# EAGLE schematic WizHorizonObserver (EAGLE 9.6.2)
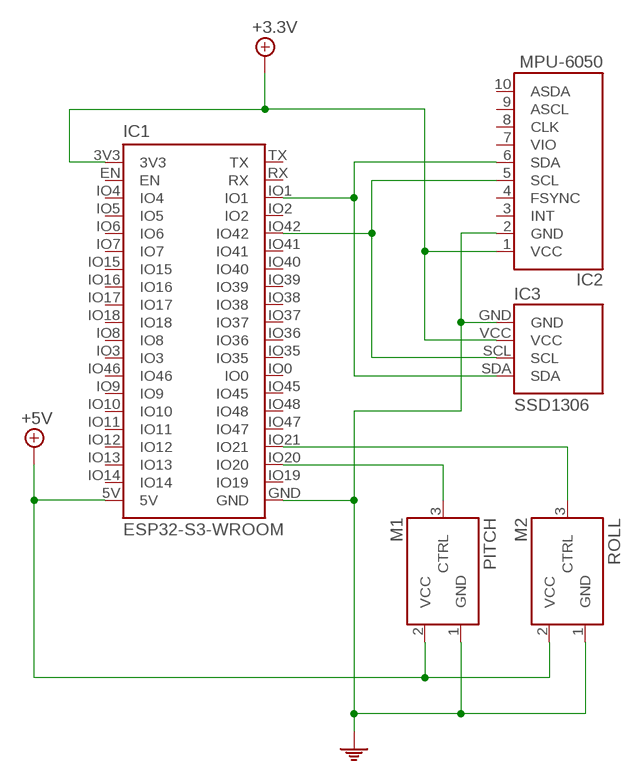
[diagram p0: schematic, sheet 1]

## Parts
IC1  ESP32-S3-WROOM  [ESP32-S3-WROOM]
IC2  MPU-6050  MPU-6050SIL10  [SIL10]
IC3  SSD1306  [SSD1306]
M1  PITCH  SERVO-MOTORSIL3  [SIL3]
M2  ROLL  SERVO-MOTORSIL3  [SIL3]

## Nets
+3.3V: IC1.3V3 IC2.1(VCC) IC3.VCC
+5V: IC1.5V M1.2(VCC) M2.2(VCC)
GND: IC1.GND IC2.2(GND) IC3.GND M1.1(GND) M2.1(GND)
N$1: IC1.IO20 M1.3(CTRL)
N$2: IC1.IO21 M2.3(CTRL)
N$3: IC1.IO1 IC2.6(SDA) IC3.SDA
N$4: IC1.IO42 IC2.5(SCL) IC3.SCL
Unconnected: IC1.EN IC1.IO0 IC1.IO2 IC1.IO3 IC1.IO4 IC1.IO5 IC1.IO6 IC1.IO7 IC1.IO8 IC1.IO9 IC1.IO10 IC1.IO11 IC1.IO12 IC1.IO13 IC1.IO14 IC1.IO15 IC1.IO16 IC1.IO17 IC1.IO18 IC1.IO19 IC1.IO35 IC1.IO36 IC1.IO37 IC1.IO38 IC1.IO39 IC1.IO40 IC1.IO41 IC1.IO45 IC1.IO46 IC1.IO47 IC1.IO48 IC1.RX IC1.TX IC2.3(INT) IC2.4(FSYNC) IC2.7(VIO) IC2.8(CLK) IC2.9(ASCL) IC2.10(ASDA)

## Library data of the parts
IC1 = wizzent:ESP32-S3-WROOM: ESP32-S3-WROOM
IC2 = wizzent:MPU-6050: MPU-6050
IC3 = wizzent:SSD1306: SSD1306
M1 M2 = wizzent:SERVO-MOTOR: SERVO-MOTOR